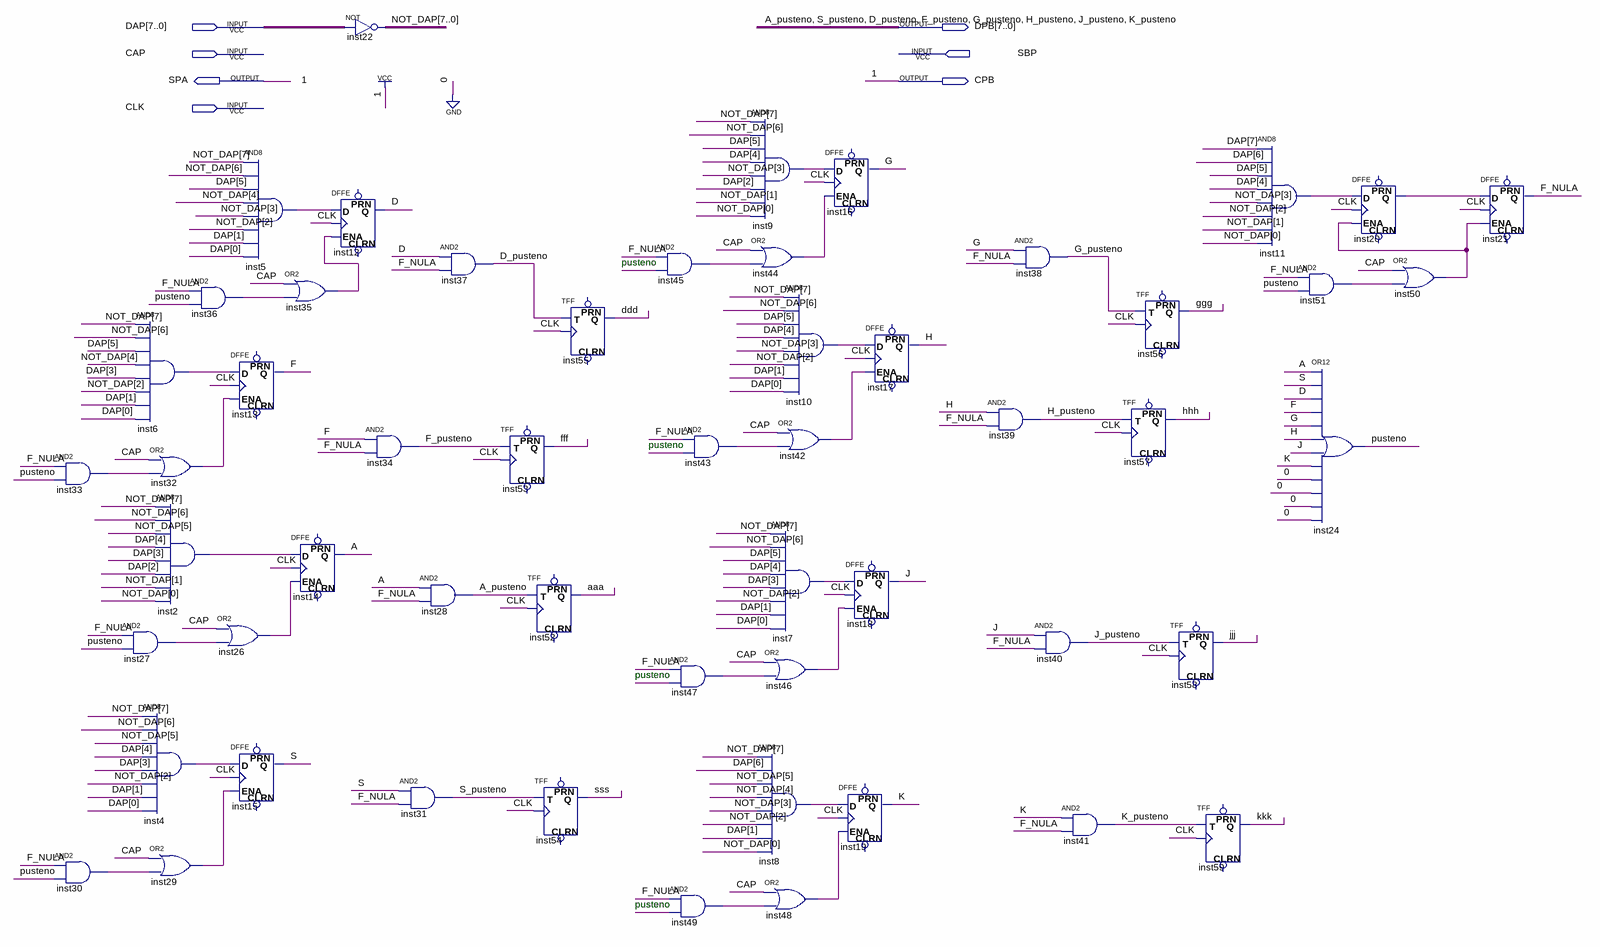
[diagram p0: schematic sheet]
// Quartus schematic P.bdf as structural Verilog: 55 symbols, 7 pins
module P (
  input  [7:0] DAP,
  input  CAP,
  input  SBP,
  input  CLK,
  output [7:0] DPB,
  output SPA,
  output CPB
);

  wire A, aaa, D, ddd, F, F_NULA, fff, G, ggg, H, hhh, inst2_out, inst4_out, inst5_out, inst6_out, inst7_out,
       inst8_out, inst9_out, inst10_out, inst11_out, inst20_q, inst26_out, inst27_out, inst29_out,
       inst30_out, inst32_out, inst33_out, inst35_out, inst36_out, inst42_out, inst43_out, inst44_out,
       inst45_out, inst46_out, inst47_out, inst48_out, inst49_out, inst50_out, inst51_out, J, jjj, K, kkk,
       pusteno, S, sss;
  wire [7:0] NOT_DAP;

  and inst33 (inst33_out, F_NULA, pusteno);
  and inst30 (inst30_out, F_NULA, pusteno);
  and inst6 (inst6_out, NOT_DAP[7], NOT_DAP[6], DAP[5], NOT_DAP[4], DAP[3], NOT_DAP[2], DAP[1], DAP[0]);
  or inst32 (inst32_out, CAP, inst33_out);
  and inst2 (inst2_out, NOT_DAP[7], NOT_DAP[6], NOT_DAP[5], DAP[4], DAP[3], DAP[2], NOT_DAP[1], NOT_DAP[0]);
  and inst27 (inst27_out, F_NULA, pusteno);
  and inst4 (inst4_out, NOT_DAP[7], NOT_DAP[6], NOT_DAP[5], DAP[4], DAP[3], NOT_DAP[2], DAP[1], DAP[0]);
  or inst29 (inst29_out, CAP, inst30_out);
  and inst36 (inst36_out, F_NULA, pusteno);
  or inst26 (inst26_out, CAP, inst27_out);
  and inst5 (inst5_out, NOT_DAP[7], NOT_DAP[6], DAP[5], NOT_DAP[4], NOT_DAP[3], NOT_DAP[2], DAP[1], DAP[0]);
  DFFE inst13 (.D(inst6_out), .CLK(CLK), .ENA(inst32_out), .Q(F));  // open: PRN, CLRN
  DFFE inst15 (.D(inst4_out), .CLK(CLK), .ENA(inst29_out), .Q(S));  // open: PRN, CLRN
  DFFE inst12 (.D(inst5_out), .CLK(CLK), .ENA(inst35_out), .Q(D));  // open: PRN, CLRN
  or inst35 (inst35_out, CAP, inst36_out);
  DFFE inst14 (.D(inst2_out), .CLK(CLK), .ENA(inst26_out), .Q(A));  // open: PRN, CLRN
  assign NOT_DAP = ~DAP;  // NOT inst22, 8 bits wide
  and inst34 (DPB[4], F, F_NULA);
  and inst37 (DPB[5], D, F_NULA);
  and inst28 (DPB[7], A, F_NULA);
  and inst31 (DPB[6], S, F_NULA);
  TFF inst53 (.T(DPB[4]), .CLK(CLK), .Q(fff));  // open: PRN, CLRN
  TFF inst52 (.T(DPB[7]), .CLK(CLK), .Q(aaa));  // open: PRN, CLRN
  TFF inst54 (.T(DPB[6]), .CLK(CLK), .Q(sss));  // open: PRN, CLRN
  TFF inst55 (.T(DPB[5]), .CLK(CLK), .Q(ddd));  // open: PRN, CLRN
  and inst45 (inst45_out, F_NULA, pusteno);
  and inst43 (inst43_out, F_NULA, pusteno);
  and inst47 (inst47_out, F_NULA, pusteno);
  and inst49 (inst49_out, F_NULA, pusteno);
  and inst9 (inst9_out, NOT_DAP[7], NOT_DAP[6], DAP[5], DAP[4], NOT_DAP[3], DAP[2], NOT_DAP[1], NOT_DAP[0]);
  or inst44 (inst44_out, CAP, inst45_out);
  or inst46 (inst46_out, CAP, inst47_out);
  and inst8 (inst8_out, NOT_DAP[7], DAP[6], NOT_DAP[5], NOT_DAP[4], NOT_DAP[3], NOT_DAP[2], DAP[1], NOT_DAP[0]);
  or inst48 (inst48_out, CAP, inst49_out);
  and inst10 (inst10_out, NOT_DAP[7], NOT_DAP[6], DAP[5], DAP[4], NOT_DAP[3], NOT_DAP[2], DAP[1], DAP[0]);
  or inst42 (inst42_out, CAP, inst43_out);
  and inst7 (inst7_out, NOT_DAP[7], NOT_DAP[6], DAP[5], DAP[4], DAP[3], NOT_DAP[2], DAP[1], DAP[0]);
  DFFE inst16 (.D(inst9_out), .CLK(CLK), .ENA(inst44_out), .Q(G));  // open: PRN, CLRN
  DFFE inst17 (.D(inst10_out), .CLK(CLK), .ENA(inst42_out), .Q(H));  // open: PRN, CLRN
  DFFE inst18 (.D(inst7_out), .CLK(CLK), .ENA(inst46_out), .Q(J));  // open: PRN, CLRN
  DFFE inst19 (.D(inst8_out), .CLK(CLK), .ENA(inst48_out), .Q(K));  // open: PRN, CLRN
  and inst38 (DPB[3], G, F_NULA);
  and inst39 (DPB[2], H, F_NULA);
  and inst40 (DPB[1], J, F_NULA);
  and inst41 (DPB[0], K, F_NULA);
  TFF inst56 (.T(DPB[3]), .CLK(CLK), .Q(ggg));  // open: PRN, CLRN
  TFF inst57 (.T(DPB[2]), .CLK(CLK), .Q(hhh));  // open: PRN, CLRN
  TFF inst58 (.T(DPB[1]), .CLK(CLK), .Q(jjj));  // open: PRN, CLRN
  TFF inst59 (.T(DPB[0]), .CLK(CLK), .Q(kkk));  // open: PRN, CLRN
  and inst11 (inst11_out, DAP[7], DAP[6], DAP[5], DAP[4], NOT_DAP[3], NOT_DAP[2], NOT_DAP[1], NOT_DAP[0]);
  and inst51 (inst51_out, F_NULA, pusteno);
  DFFE inst20 (.D(inst11_out), .CLK(CLK), .ENA(inst50_out), .Q(inst20_q));  // open: PRN, CLRN
  or inst24 (pusteno, A, S, D, F, G, H, J, K, 1'b0, 1'b0, 1'b0, 1'b0);
  or inst50 (inst50_out, CAP, inst51_out);
  DFFE inst21 (.D(inst20_q), .CLK(CLK), .ENA(inst50_out), .Q(F_NULA));  // open: PRN, CLRN

  assign CPB = 1'b1;
  assign SPA = 1'b1;

  // Other names for the same wires on the sheet: A_pusteno = DPB[7]; D_pusteno = DPB[5]; F_pusteno = DPB[4];
  //   G_pusteno = DPB[3]; H_pusteno = DPB[2]; J_pusteno = DPB[1]; K_pusteno = DPB[0]; S_pusteno = DPB[6]

  // Notes on the sheet:
  //   pusteno
  //   pusteno
  //   pusteno
  //   pusteno
endmodule
